# Altium schematic sheet AcquisitionAnalog.SchDoc
size A3; SheetNumber: 2; SheetTotal: 4
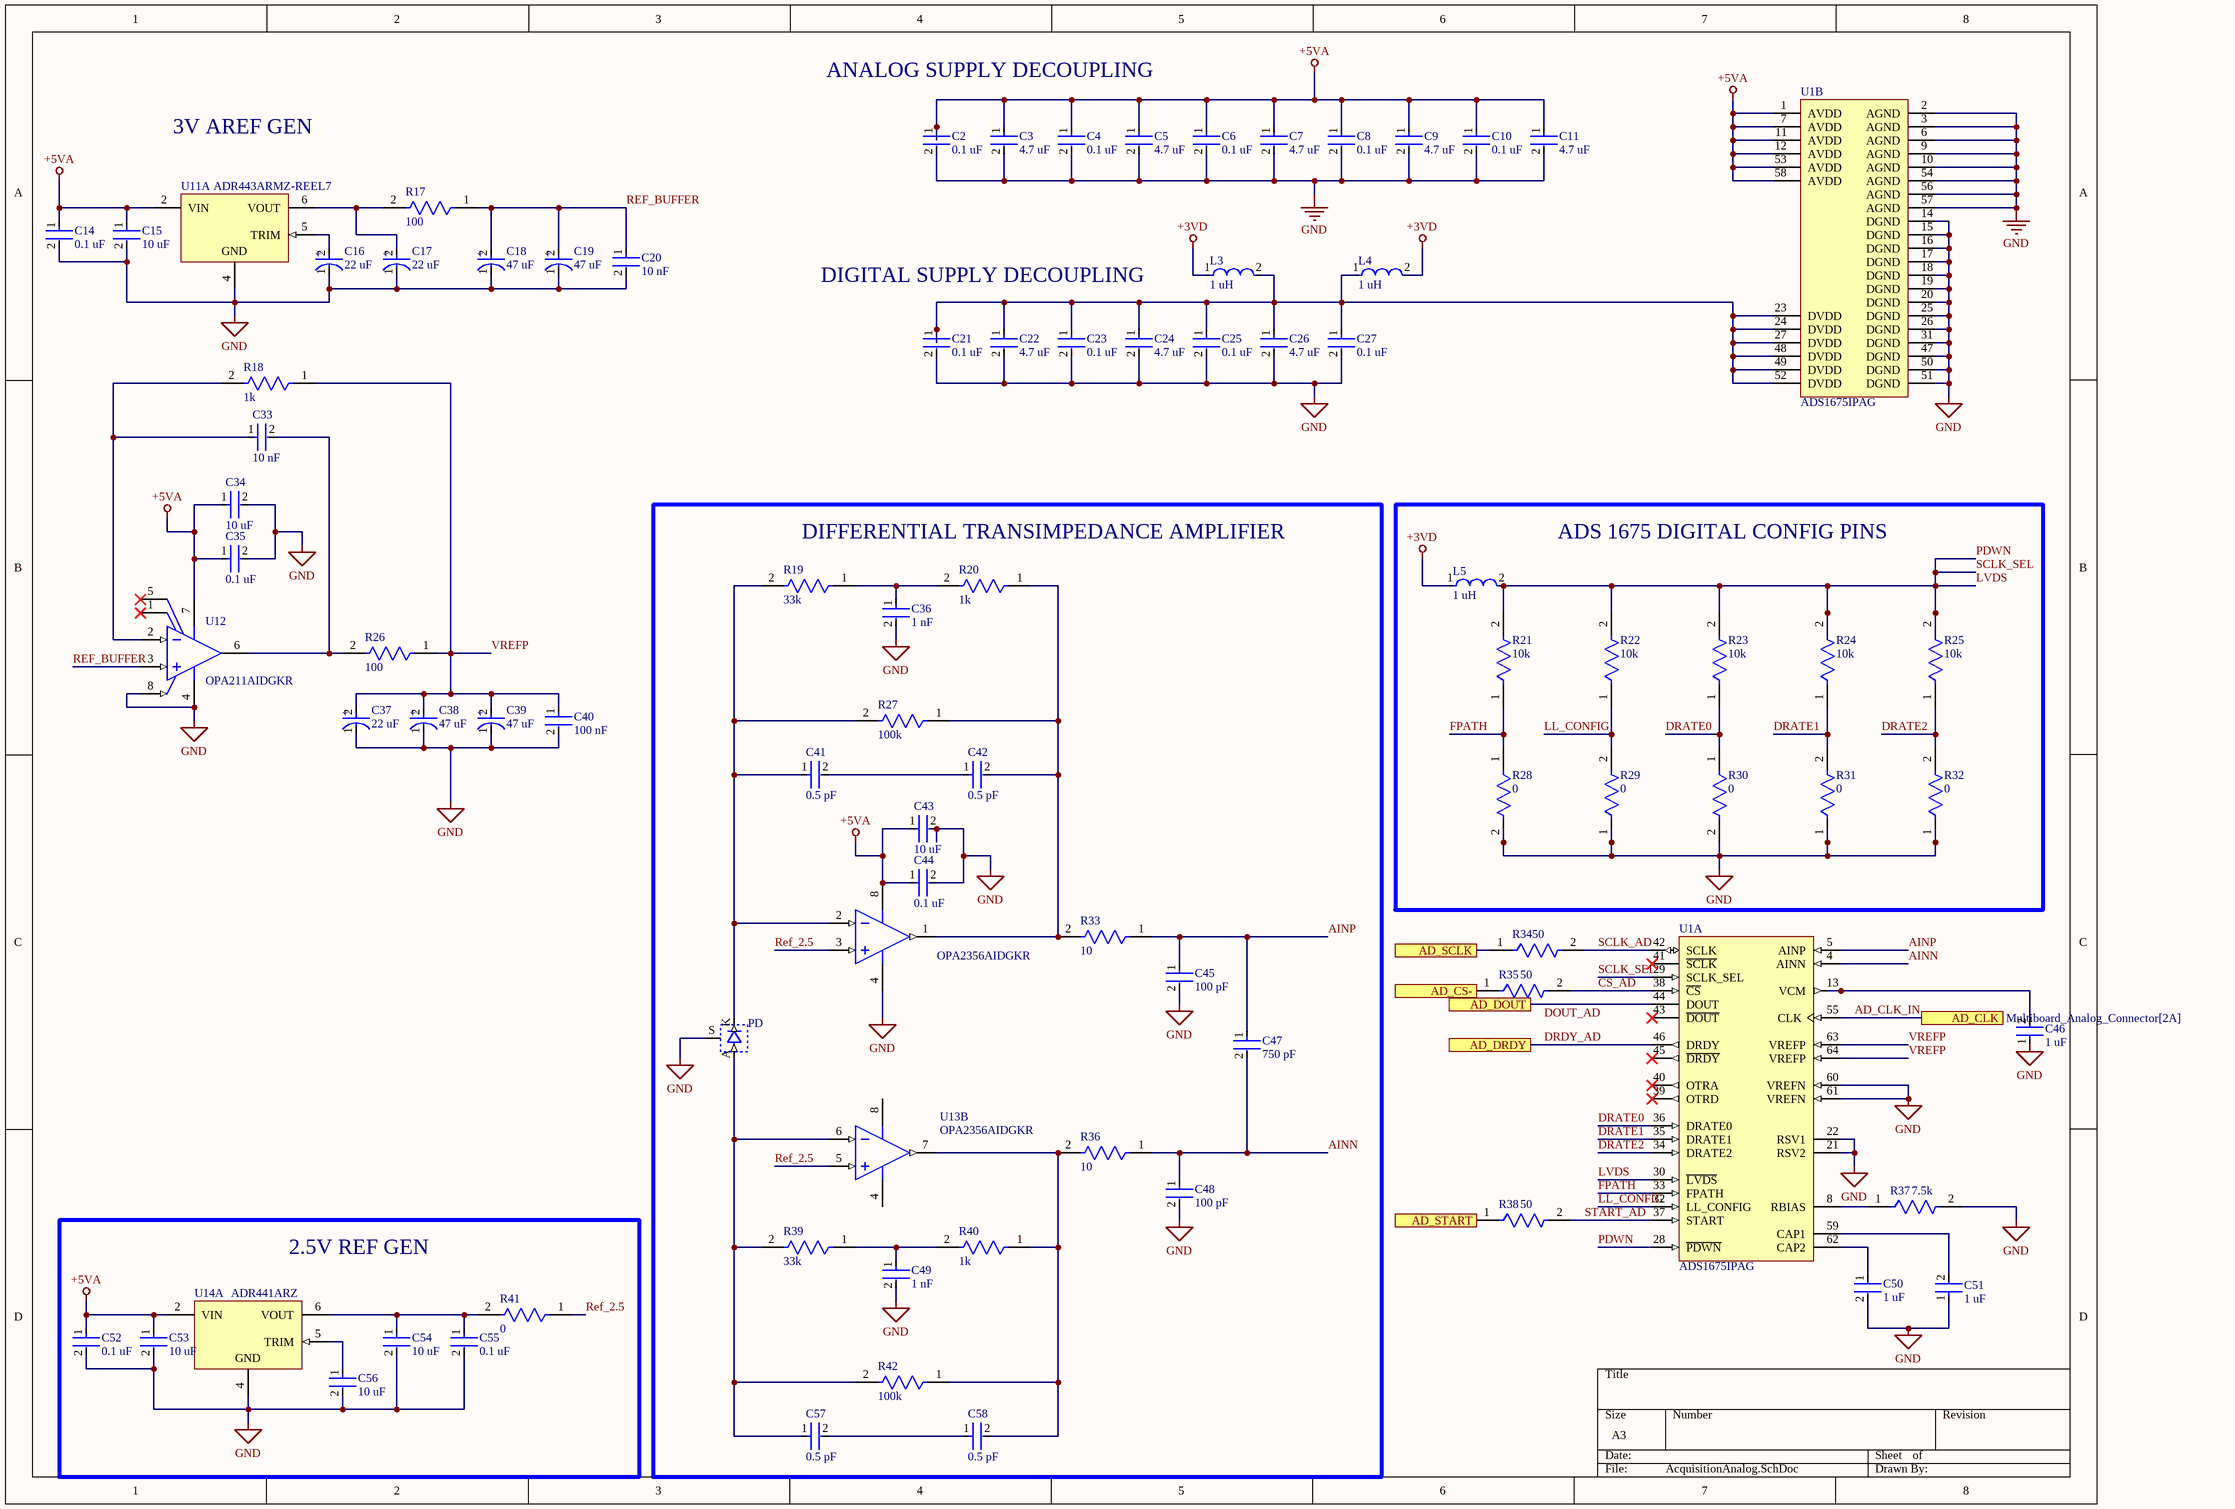
[diagram p0: AcquisitionAnalog.SchDoc]

## Parts
C2  0.1 uF  [FP-CC0805-0_85-MFG]
C3  4.7 uF  [FP-CC0805-0_85-MFG]
C4  0.1 uF  [FP-CC0805-0_85-MFG]
C5  4.7 uF  [FP-CC0805-0_85-MFG]
C6  0.1 uF  [FP-CC0805-0_85-MFG]
C7  4.7 uF  [FP-CC0805-0_85-MFG]
C8  0.1 uF  [FP-CC0805-0_85-MFG]
C9  4.7 uF  [FP-CC0805-0_85-MFG]
C10  0.1 uF  [FP-CC0805-0_85-MFG]
C11  4.7 uF  [FP-CC0805-0_85-MFG]
C14  0.1 uF  [FP-CC0805-0_85-MFG]
C15  10 uF  [FP-CC0805-0_85-MFG]
C16  22 uF  [FP-TAJP-MFG]
C17  22 uF  [FP-TAJP-MFG]
C18  47 uF  [FP-TAJP-MFG]
C19  47 uF  [FP-TAJP-MFG]
C20  10 nF  [FP-CC0805-0_85-MFG]
C21  0.1 uF  [FP-CC0805-0_85-MFG]
C22  4.7 uF  [FP-CC0805-0_85-MFG]
C23  0.1 uF  [FP-CC0805-0_85-MFG]
C24  4.7 uF  [FP-CC0805-0_85-MFG]
C25  0.1 uF  [FP-CC0805-0_85-MFG]
C26  4.7 uF  [FP-CC0805-0_85-MFG]
C27  0.1 uF  [FP-CC0805-0_85-MFG]
C33  10 nF  [FP-CC0805-0_85-MFG]
C34  10 uF  [FP-CC0805-0_85-MFG]
C35  0.1 uF  [FP-CC0805-0_85-MFG]
C36  1 nF  [FP-CC0805-0_85-MFG]
C37  22 uF  [FP-TAJP-MFG]
C38  47 uF  [FP-TAJP-MFG]
C39  47 uF  [FP-TAJP-MFG]
C40  100 nF  [FP-CC0805-0_85-MFG]
C41  0.5 pF  [FP-CC0805-0_85-MFG]
C42  0.5 pF  [FP-CC0805-0_85-MFG]
C43  10 uF  [FP-CC0805-0_85-MFG]
C44  0.1 uF  [FP-CC0805-0_85-MFG]
C45  100 pF  [FP-CC0805-0_85-MFG]
C46  1 uF  [FP-CC0805-0_85-MFG]
C47  750 pF  [FP-CC0805-0_85-MFG]
C48  100 pF  [FP-CC0805-0_85-MFG]
C49  1 nF  [FP-CC0805-0_85-MFG]
C50  1 uF  [FP-CC0805-0_85-MFG]
C51  1 uF  [FP-CC0805-0_85-MFG]
C52  0.1 uF  [FP-CC0805-0_85-MFG]
C53  10 uF  [FP-CC0805-0_85-MFG]
C54  10 uF  [FP-CC0805-0_85-MFG]
C55  0.1 uF  [FP-CC0805-0_85-MFG]
C56  10 uF  [FP-CC0805-0_85-MFG]
C57  0.5 pF  [FP-CC0805-0_85-MFG]
C58  0.5 pF  [FP-CC0805-0_85-MFG]
L3  1 uH  [FP-LQM21DN_00-IPC_B]
L4  1 uH  [FP-LQM21DN_00-IPC_B]
L5  1 uH  [FP-LQM21DN_00-IPC_B]
PD  (no value)  [otico]
R17  100  [FP-RR1220-MFG]
R18  1k  [FP-RR1220-MFG]
R19  33k  [FP-RR1220-MFG]
R20  1k  [FP-RR1220-MFG]
R21  10k  [FP-RR1220-MFG]
R22  10k  [FP-RR1220-MFG]
R23  10k  [FP-RR1220-MFG]
R24  10k  [FP-RR1220-MFG]
R25  10k  [FP-RR1220-MFG]
R26  100  [FP-RR1220-MFG]
R27  100k  [FP-RR1220-MFG]
R28  0  [FP-RR1220-MFG]
R29  0  [FP-RR1220-MFG]
R30  0  [FP-RR1220-MFG]
R31  0  [FP-RR1220-MFG]
R32  0  [FP-RR1220-MFG]
R33  10  [FP-RR1220-MFG]
R34  50  [FP-RR1220-MFG]
R35  50  [FP-RR1220-MFG]
R36  10  [FP-RR1220-MFG]
R37  7.5k  [FP-RR1220-MFG]
R38  50  [FP-RR1220-MFG]
R39  33k  [FP-RR1220-MFG]
R40  1k  [FP-RR1220-MFG]
R41  0  [FP-RR1220-MFG]
R42  100k  [FP-RR1220-MFG]
U1  ADS1675IPAG  [TI-PAG64_L]  (parts A,B of 2)
U11  ADR443ARMZ-REEL7  [ADI-RM-8_L]  (part A of 2)
U12  OPA211AIDGKR  [DGK0008A_M]
U13  OPA2356AIDGKR  [DGK0008A_M]  (parts A,B of 2)
U14  ADR441ARZ  [ADI-R-8_L]  (part A of 2)

## Blocks framed on the sheet
DIFFERENTIAL TRANSIMPEDANCE AMPLIFIER: C36 C41-C45 C47-C49 C57 C58 PD R19 R20 R27 R33 R36 R39 R40 R42 U13
ADS 1675 DIGITAL CONFIG PINS: L5 R21-R25 R28-R32
2.5V REF GEN: C52-C56 R41 U14

## Ports
AD_CLK (see Multiboard_Analog_Connector[2A]), AD_CS- (see Multiboard_Analog_Connector[2A]), AD_DOUT (see Multiboard_Analog_Connector[2A]), AD_DRDY (see Multiboard_Analog_Connector[2A]), AD_SCLK (see Multiboard_Analog_Connector[2A]), AD_START (see Multiboard_Analog_Connector[2A])

## Nets
+3VD: L3.1 L4.2 L5.1
+5VA: C2.1 C3.1 C4.1 C5.1 C6.1 C7.1 C8.1 C9.1 C10.1 C11.1 C14.1 C15.1 C34.1 C35.1 C43.1 C44.1 C52.1 C53.1 U1.1(AVDD) U1.7(AVDD) U1.11(AVDD) U1.12(AVDD) U1.53(AVDD) U1.58(AVDD) U11.2(VIN) U12.7(V+) U13.8(V+) U14.2(VIN)
GND: C2.2 C3.2 C4.2 C5.2 C6.2 C7.2 C8.2 C9.2 C10.2 C11.2 C14.2 C15.2 C16.1(C) C17.1(C) C18.1(C) C19.1(C) C20.2 C21.2 C22.2 C23.2 C24.2 C25.2 C26.2 C27.2 C34.2 C35.2 C36.2 C37.1(C) C38.1(C) C39.1(C) C40.2 C43.2 C44.2 C45.2 C46.1 C48.2 C49.2 C50.2 C51.1 C52.2 C53.2 C54.2 C55.2 C56.2 PD.S R28.2 R29.1 R30.2 R31.1 R32.1 R37.2 U1.2(AGND) U1.3(AGND) U1.6(AGND) U1.9(AGND) U1.10(AGND) U1.14(DGND) U1.15(DGND) U1.16(DGND) U1.17(DGND) U1.18(DGND) U1.19(DGND) U1.20(DGND) U1.21(RSV2) U1.22(RSV1) U1.25(DGND) U1.26(DGND) U1.31(DGND) U1.47(DGND) U1.50(DGND) U1.51(DGND) U1.54(AGND) U1.56(AGND) U1.57(AGND) U1.60(VREFN) U1.61(VREFN) U11.4(GND) U12.4(V-) U12.8(SHUTDOWN) U13.4(V-) U14.4(GND)
AD_CLK_IN: U1.55(CLK) ; port AD_CLK
AD_CS-: R35.1 ; port AD_CS-
AD_SCLK: R34.1 ; port AD_SCLK
AD_START: R38.1 ; port AD_START
AINN: C47.2 C48.1 R36.1 U1.4(AINN)
AINP: C45.1 C47.1 R33.1 U1.5(AINP)
CS_AD: R35.2 U1.38(~{CS})
DOUT_AD: U1.44(DOUT) ; port AD_DOUT
DRATE0: R23.1 R30.1 U1.36(DRATE0)
DRATE1: R24.1 R31.2 U1.35(DRATE1)
DRATE2: R25.1 R32.2 U1.34(DRATE2)
DRDY_AD: U1.46(DRDY) ; port AD_DRDY
FPATH: R21.1 R28.1 U1.33(FPATH)
LL_CONFIG: R22.1 R29.2 U1.32(LL_CONFIG)
LVDS: L5.2 R21.2 R22.2 R23.2 R24.2 R25.2 U1.28(~{PDWN}) U1.29(SCLK_SEL) U1.30(~{LVDS})  [also labelled PDWN, SCLK_SEL]
Ref_2.5: R41.1 U13.3(IN_A+) U13.5(IN_B+)
REF_BUFFER: C18.2(A) C19.2(A) C20.1 R17.1 U12.3(IN+)
SCLK_AD: R34.2 U1.42(SCLK)
START_AD: R38.2 U1.37(START)
VREFP: C37.2(A) C38.2(A) C39.2(A) C40.1 R18.1 R26.1 U1.63(VREFP) U1.64(VREFP)
NetC16_2: C16.2(A) U11.5(TRIM)
NetC17_2: C17.2(A) R17.2 U11.6(VOUT)
NetC21_1: C21.1 C22.1 C23.1 C24.1 C25.1 C26.1 C27.1 L3.2 L4.1 U1.23(DVDD) U1.24(DVDD) U1.27(DVDD) U1.48(DVDD) U1.49(DVDD) U1.52(DVDD)
NetC33_1: C33.1 R18.2 U12.2(IN-)
NetC33_2: C33.2 R26.2 U12.6(OUT)
NetC36_1: C36.1 R19.1 R20.2
NetC41_1: C41.1 PD.K R19.2 R27.2 U13.2(IN_A-)
NetC41_2: C41.2 C42.1
NetC42_2: C42.2 R20.1 R27.1 R33.2 U13.1(OUT_A)
NetC46_2: C46.2 U1.13(VCM)
NetC49_1: C49.1 R39.1 R40.2
NetC50_1: C50.1 U1.62(CAP2)
NetC51_2: C51.2 U1.59(CAP1)
NetC54_1: C54.1 C55.1 R41.2 U14.6(VOUT)
NetC56_1: C56.1 U14.5(TRIM)
NetC57_1: C57.1 PD.A R39.2 R42.2 U13.6(IN_B-)
NetC57_2: C57.2 C58.1
NetC58_2: C58.2 R36.2 R40.1 R42.1 U13.7(OUT_B)
NetR37_1: R37.1 U1.8(RBIAS)

Not connected (* = marked no-connect by the designer): U1 39(OTRD)* 40(OTRA)* 41(~{SCLK})* 43(~{DOUT})* 45(~{DRDY})*; U12 1(NC)* 5(NC)*

## Notes on the sheet
- ANALOG SUPPLY DECOUPLING
- 3V AREF GEN
- DIGITAL SUPPLY DECOUPLING
- (in symbol CMP-2007-04028-2) +

## Library data of the parts
C2-C11 C14 C15 C20-C27 C33-C36 C41-C58 = CMP-1036-04410-2: CAP CER 0.1UF 25V X7R 0805; Manufacturer Part Number: CC0805KRX7R8BB104; Manufacturer: Yageo; Tolerance: 0.1; Material: Ceramic; Value: 100 nF; ComponentLink2URL: http://www.yageo.com/documents/recent/UPY-GPHC_Y5V_6.3V-to-50V_8.pdf; Category: Cap; Mouser Description: Multilayer Ceramic Capacitors MLCC - SMD/SMT 100nF 25V X7R 10%; Device Class L1: Passive Components; Footprint Url: http://www.yageo.com/exep/pages/download/literatures/UPY-C_GEN_24.pdf; Height: 0.95mm; Digikey Description: CAP CER 0.1UF 25V X7R 0805; Lead Free: Yes; Temperature Range High: +85°C; Temperature: -30°C to +85°C; Ipc Land Pattern Name: CAPC200125X85; Capacitance: 100 nF; Automotive: No; Octopart: https://octopart.com/cc0805krx7r8bb104-yageo-39467766; Device Class L2: Capacitors; Temperature Characteristic: X7R; Voltage Rating: 25 V; ComponentLink2Description: Datasheet; Temperature Range Low: -30°C; Device Class L3: Ceramic Capacitors; RoHS: TRUE; Package: CC0805-0.85
C16-C19 C37-C39 = CMP-2007-04028-2: 10uF 10V  ±20% 6Ω 0805  SMD Tantalum Capacitor; Dissipation Factor: 8%; ESR (Equivalent Series Resistance): 6R; Polarity: Polar; Leakage Current: 1uA; Height: 1.5mm; Packaging: Tape and Reel; Max Operating Temperature: 125°C; Lead Free: Lead Free; Length: 2.05mm; RoHS Compliant: Yes; Number of Pins: 2; Case Code (Metric): 2012; Series: TAJ; Height - Seated (Max): 0.059inch; Mount: Surface Mount; REACH SVHC: No SVHC; Depth: 1.35mm; Tolerance: 20%; Case Code (Imperial): 0805; Dielectric Material: Tantalum; Features: General Purpose; Voltage: 10V; Capacitance: 10uF; Package Quantity: 1; Case/Package: 0805; Voltage Rating (DC): 10V; Termination: SMD/SMT; Width: 0.053inch; Min Operating Temperature: -55°C; Voltage Rating: 10V
C40 = CMP-1036-04410-2: CAP CER 0.1UF 25V X7R 0805; Manufacturer Part Number: CC0805KRX7R8BB104; Manufacturer: Yageo; Tolerance: 0.1; Material: Ceramic; ComponentLink2URL: http://www.yageo.com/documents/recent/UPY-GPHC_Y5V_6.3V-to-50V_8.pdf; Category: Cap; Mouser Description: Multilayer Ceramic Capacitors MLCC - SMD/SMT 100nF 25V X7R 10%; Device Class L1: Passive Components; Footprint Url: http://www.yageo.com/exep/pages/download/literatures/UPY-C_GEN_24.pdf; Height: 0.95mm; Digikey Description: CAP CER 0.1UF 25V X7R 0805; Lead Free: Yes; Temperature Range High: +85°C; Temperature: -30°C to +85°C; Ipc Land Pattern Name: CAPC200125X85; Value: 100 nF; Capacitance: 100 nF; Automotive: No; Octopart: https://octopart.com/cc0805krx7r8bb104-yageo-39467766; Device Class L2: Capacitors; Temperature Characteristic: X7R; Voltage Rating: 25 V; ComponentLink2Description: Datasheet; Temperature Range Low: -30°C; Device Class L3: Ceramic Capacitors; RoHS: TRUE; Package: CC0805-0.85
L3-L5 = CMP-06042-012978-1: Multilayer Type Inductor for General Circuits, 0805 (2012), 1μH, 10%, 0.4Ω, 50mA; Q Factor: 45; Test Frequency: 10MHz; DC Resistance (DCR): 400mR; Core Material: Ferrite; Shielding: Shielded; Inductance: 1uH; Self Resonant Frequency: 107MHz; Mount: Surface Mount; Depth: 1.45mm; Current Rating: 50mA; Lead Free: Lead Free; Height - Seated (Max): 0.041inch; Inductance Tolerance: 10%; Min Operating Temperature: -40°C; Height: 0.85mm; Radiation Hardening: No; Width: 1.25mm; Length: 2mm; Case Code (Imperial): 0805; Termination: SMD/SMT; Package Quantity: 1; Max Operating Temperature: 85°C; Case Code (Metric): 2012; Case/Package: 0805; Max DC Current: 50mA; DC Current: 50mA; Military Standard: Not; REACH SVHC: No SVHC; Packaging: Tape and Reel; Tolerance: 10%
PD = BYW29-150: Text Field1: 10; Text Field2: 20
R17-R42 = CMP-2001-03560-2: 49.9Ω ±0.5% 0.1W 1/10W Chip Resistor 0805 (2012 Metric) Thin Film; Voltage Rating: 100V; Temperature Coefficient: 50ppm/°C; Max Power Dissipation: 100mW; Resistance: 49.9R; Packaging: Tape and Reel; Length: 0.079inch; Termination: SMD/SMT; Case Code (Metric): 2012; Voltage Rating (DC): 100V; Height: 0.02inch; Width: 0.049inch; RoHS Compliant: Yes; Tolerance: 0.5%; Case/Package: 0805; Resistance Tolerance: 0.5%; Lead Free: Lead Free; Size Code: 0805; Min Operating Temperature: -55°C; Max Operating Temperature: 125°C; Case Code (Imperial): 0805; Package Quantity: 1; Resistor Type: Thin Film; Number of Terminations: 2; Power Rating: 100mW; Series: RR
U1 = CMP-0003-00593-1: 4 MSPS, 24-Bit ADC, -40 to 85 degC, 64-pin QFP (PAG64), Green (RoHS & no Sb/Br); Manufacturer: Texas Instruments; Analog Voltage AV/DD(Min)(V): 4.75; Analog Voltage AV/DD(Max)(V): 5.25; SFDR(dB): 120; Resolution(Bits): 24; # Input Channels: 1; SubFamily: Precision ADC (<=10MSPS); Architecture: Delta-Sigma; SNR(dB): 92; Digital Supply(Min)(V): 2.85; Sample Rate (max)(SPS): 4M; Digital Supply(Max)(V): 3.15; Interface: Parallel LVDS, Serial SPI; Eco-Plan: Green (RoHS & no Sb/Br); ComponentLink3URL: http://www.ti.com/lit/ml/mtqf006a/mtqf006a.pdf; PackageDescription: 64-Pin Plastic Flat Pack, Body 10 x 10 mm, Pitch 0.50 mm; PackageVersion: 4040282/C, 11/1996; Mounting Technology: Surface Mount; ComponentLink1URL: http://www.ti.com/; ComponentLink2URL: http://www.ti.com/general/docs/lit/getliterature.tsp?genericPartNumber=ADS1675&fileType=pdf; PartNumber: ADS1675IPAG; ComponentLink2Description: Datasheet; ComponentLink3Description: Package Specification; PackageReference: PAG64; ComponentLink1Description: Manufacturer URL; Code_JEDEC: MS-026; DatasheetVersion: SBAS416D
U11 = CMP-0784-00377-1: Ultralow Noise, LDO XFET Voltage Reference with Current Sink and Source, 3 V Output, 3.5 to 18 V Supply, Industrial, 8-pin SOP (RM-8), Reel; Manufacturer: Analog Devices; Ref Out TC (ppm/C): 2; Min V Supply (V): 3.5; Max V Supply (V): 18; Vout: 3V; ComponentLink3URL: http://www.analog.com/static/imported-files/packages/PKG_PDF/MSOP%28RM%29/RM_8.pdf; ComponentLink2URL: http://www.analog.com/static/imported-files/data_sheets/ADR440_441_443_444_445.pdf; ComponentLink2Description: Datasheet; PackageVersion: Aug-05; Mounting Technology: Surface Mount; ComponentLink1Description: Manufacturer URL; PartNumber: ADR443ARMZ-REEL7; DatasheetVersion: Rev. E; PackageDescription: 8-Pin Mini Small Outline Package, Body 3 x 3 mm, Pitch 0.65 mm; ComponentLink4Description: URL Link1; ComponentLink1URL: http://www.analog.com/en/index.html; ComponentLink4URL: Product URL:http://www.analog.com/en/special-linear-functions/voltage-references/adr443/products/product.html; Operating Temp Range: -40 to 125 degC; Code_JEDEC: MO-187-AA; ComponentLink3Description: Package Specification; PackageReference: RM-8; Packing: Reel
U12 = CMP-0272-01174-3: 1.1 nV/rtHz Noise, Low Power, Precision Operational Amplifier, 4.5 to 36 V, -40 to 125 degC, 8-pin SOP (DGK8), Green (RoHS & no Sb/Br); Manufacturer: Texas Instruments; IIB(Max)(pA): 175000; CMRR(Min)(dB): 114; Sub Family: High Supply Voltage Amplifier (>=30V), Low Noise Amp (<=10nV/rtHz), Low Offset Voltage Amplifier (<=500uV), Precision Amplifier; Number of Channels: 1; Total Supply Voltage(Max)(+5V is 5, +/-5V is 10): 36; Packing: LARGE T&R; Slew Rate(Typ)(V/us): 27; Iq per channel(Max)(mA): 4.5; Vio (25C)(Max)(mV): 0.125; GBW(Typ)(MHz): 45; Rating: Catalog; Offset Drift(Typ)(uV/C): 0.15; DatasheetVersion: SBOS377G; ComponentLink2URL: http://www.ti.com/lit/ds/symlink/opa211.pdf; PackageReference: DGK0008A; Mounting Technology: Surface Mount; ComponentLink3URL: http://www.ti.com/litv/pdf/mpds028d; Eco-Plan: Green (RoHS & no Sb/Br); ComponentLink1Description: Manufacturer URL; PartNumber: OPA211AIDGKR; PackageDescription: 8-Pin Thin Small Outline, Body 3 x 3 mm, Pitch 0.65 mm; ComponentLink3Description: Package Specification; Code_JEDEC: MO-187; ComponentLink2Description: Datasheet; PackageVersion: 4073329/E, 05/2006; ComponentLink1URL: http://www.ti.com/; Total Supply Voltage(Min)(+5V is 5, +/-5V is 10): 4.5
U13 = CMP-0018-00589-2: 200 MHz GBW, CMOS Dual Operational Amplifier, 2.5 to 5.5 V, -40 to 125 degC, 8-pin SOP (DGK8), Green (RoHS & no Sb/Br); Manufacturer: Texas Instruments; Slew Rate(Typ)(V/us): 360; Acl, min stable gain(V/V): 1; 3rd Harmonic(dBc): 93; Vs(Min)(V): 2.5; Rail-Rail: Out; Diff Phase(deg): 0.05; 2nd Harmonic(dBc): 81; Vn at Flatband(Typ)(nV/rtHz): 5.8; Number of Channels: 2; Sub Family: High Output Current Amplifier (>=50mA), High Speed Amplifier (>=50MHz), Low Supply Voltage Amplifier (<=2.7V); Diff Gain(%): 0.02; Settling Time (0.1%)(Typ)(ns): 30; Iq per channel(Max)(mA): 14; THD (Fc is 1 MHz)(Typ)(dB): -79; Io(Typ)(mA): 100; Vio(Max)(mV): 9; Vs(Max)(V): 5.5; BW @ Acl(MHz): 450; PackageDescription: 8-Pin Thin Small Outline, Body 3 x 3 mm, Pitch 0.65 mm; PartNumber: OPA2356AIDGKR; Mounting Technology: Surface Mount; Eco-Plan: Green (RoHS & no Sb/Br); Code_JEDEC: MO-187; ComponentLink3Description: Package Specification; ComponentLink1URL: http://www.ti.com/; DatasheetVersion: SBOS212A; ComponentLink2Description: Datasheet; PackageReference: DGK0008A; ComponentLink2URL: http://www.ti.com/general/docs/lit/getliterature.tsp?genericPartNumber=OPA2356&fileType=pdf; ComponentLink1Description: Manufacturer URL; @ MHz: 1; Iib(Max)(nA): 0.05; ComponentLink3URL: http://www.ti.com/litv/pdf/mpds028d; PackageVersion: 4073329/E, 05/2006
U14 = CMP-0784-00172-1: Ultralow Noise, LDO XFET Voltage Reference with Current Sink and Source, 2.5 V Output, 3 to 18 V Supply, Industrial, 8-pin SOIC (R-8), Tube; Manufacturer: Analog Devices; Vout: 2.5V; Ref Out TC (ppm/C): 2; Min V Supply (V): 3; Max V Supply (V): 18; Packing: Tube; ComponentLink2URL: http://www.analog.com/static/imported-files/data_sheets/ADR440_441_443_444_445.pdf; PackageVersion: 060506-A, 06/2006; PartNumber: ADR441ARZ; PackageDescription: 8-Pin Standard Small Outline Package, Body 4.9 x 3.9 mm, Pitch 1.27 mm; PackageReference: R-8; ComponentLink2Description: Datasheet; ComponentLink3URL: http://www.analog.com/static/imported-files/packages/PKG_PDF/SOIC_Narrow%20(R)/R_8.pdf; Operating Temp Range: -40 to 125 degC; ComponentLink3Description: Package Specification; ComponentLink1Description: Manufacturer URL; Code_JEDEC: MS-012-AA; ComponentLink1URL: http://www.analog.com/en/index.html; DatasheetVersion: Rev. E; ComponentLink4URL: Product URL:http://www.analog.com/en/special-linear-functions/voltage-references/adr441/products/product.html; Mounting Technology: Surface Mount; ComponentLink4Description: URL Link1